# EAGLE design Guitar-Controller (EAGLE 6.4)
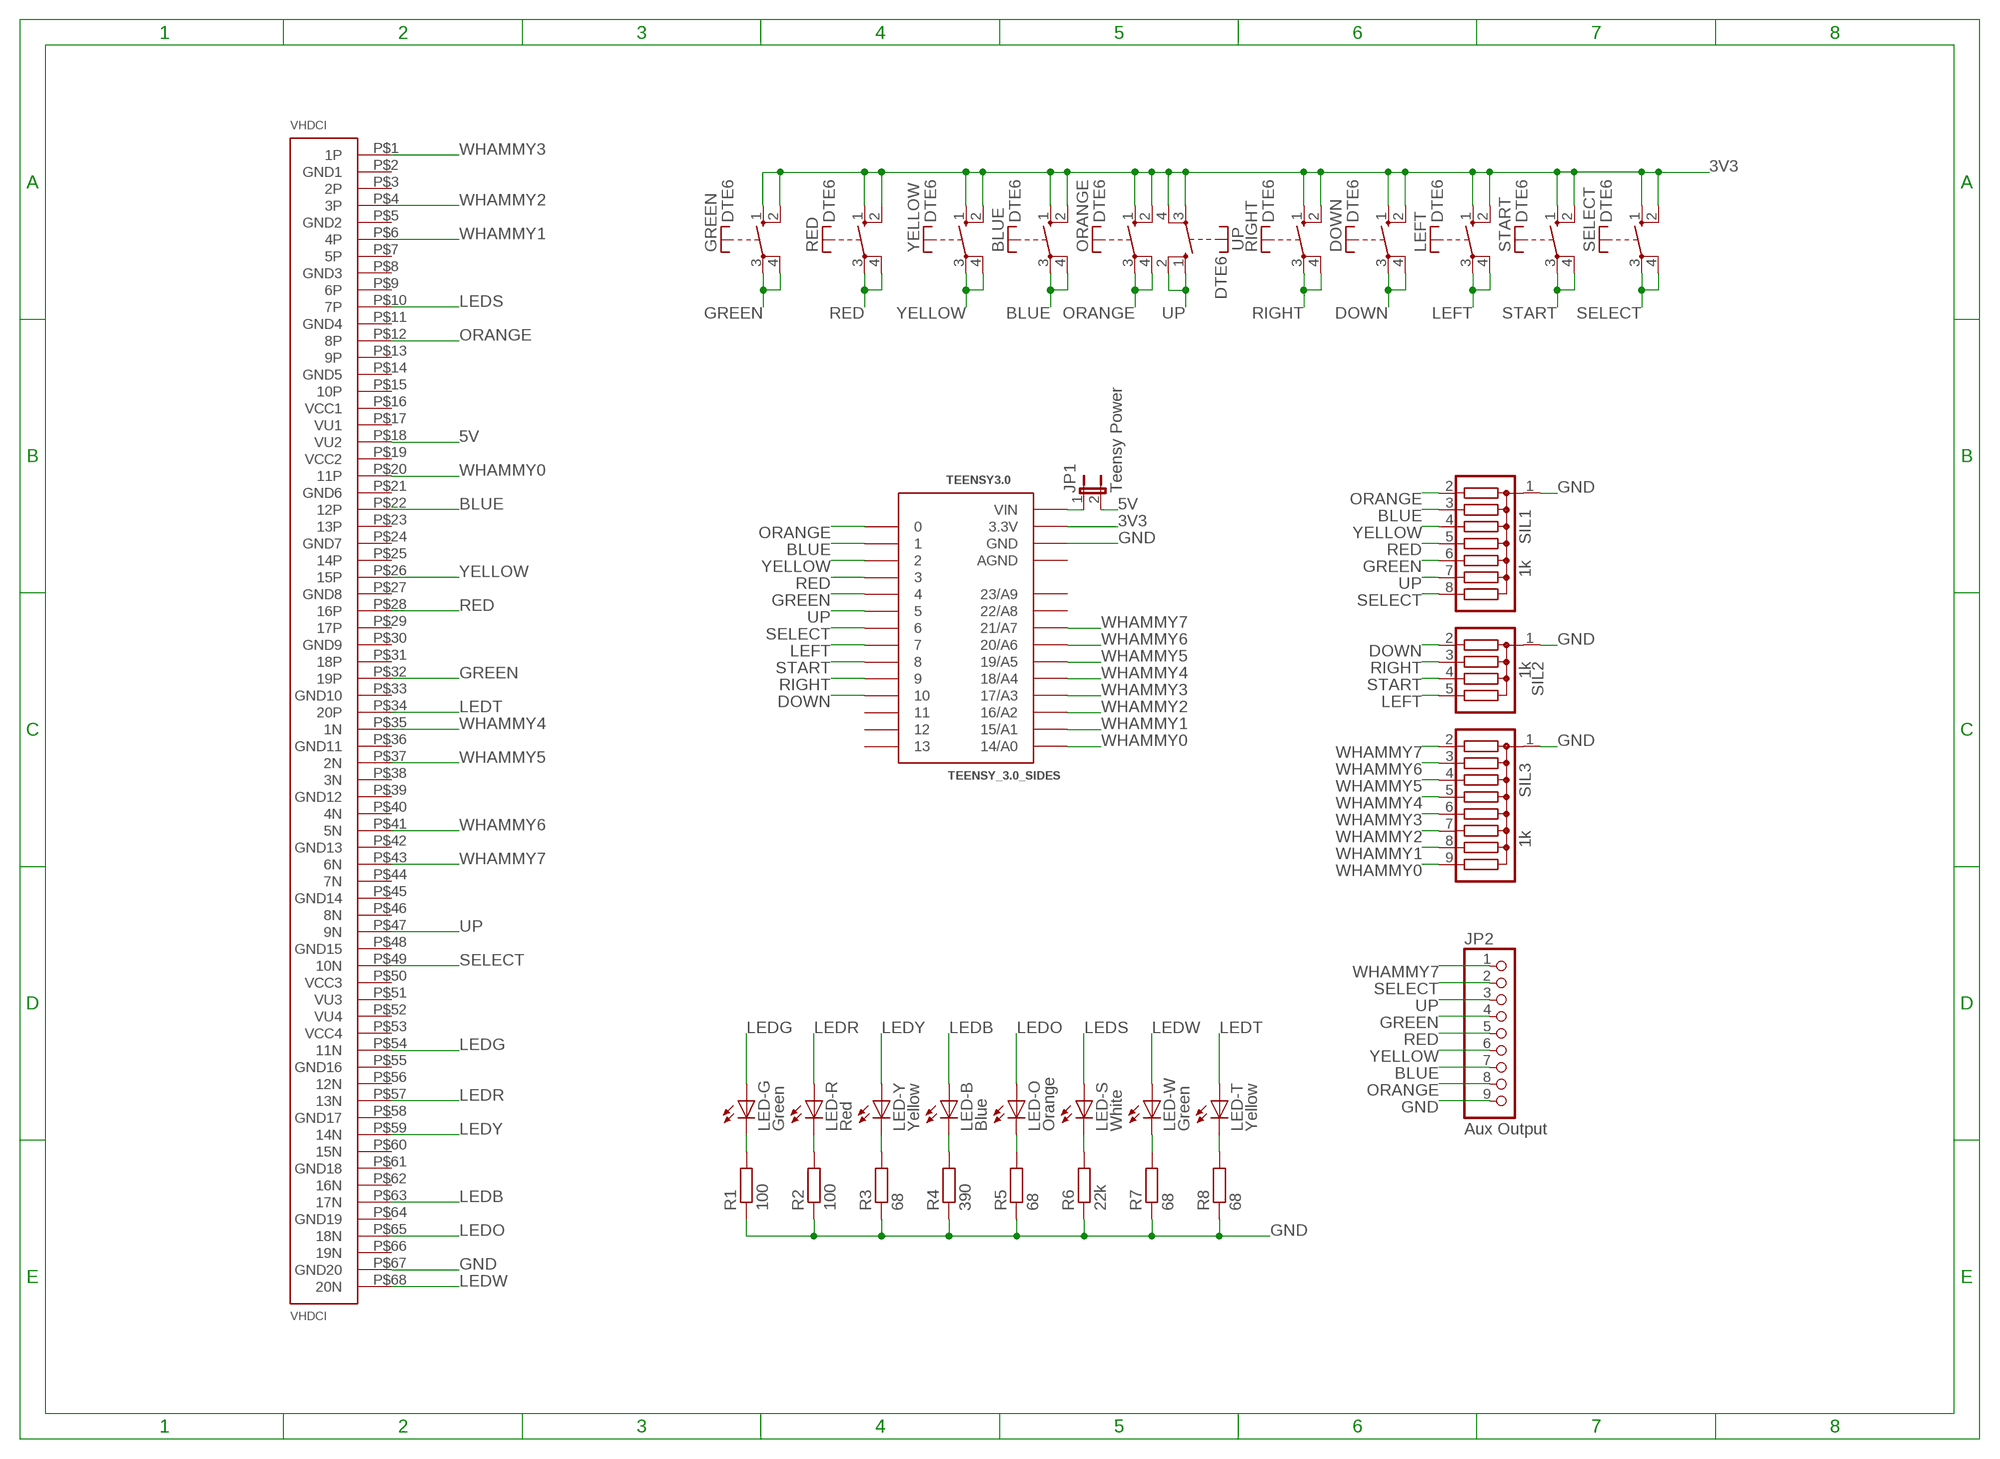
[diagram p0: schematic, sheet 1]

## Parts
BLUE  DTE6  [DTE6]
DOWN  DTE6  [DTE6]
GREEN  DTE6  [DTE6]
JP1  Teensy Power  JP1E  [JP1]
JP2  Aux Output  PINHD-1X9/90  [1X09/90]
LED-B  Blue  LEDSQR2X5  [LED2X5]
LED-G  Green  LEDSQR2X5  [LED2X5]
LED-O  Orange  LEDSQR2X5  [LED2X5]
LED-R  Red  LEDSQR2X5  [LED2X5]
LED-S  White  LED5MM  [LED5MM]
LED-T  Yellow  LED3MM  [LED3MM]
LED-W  Green  LED3MM  [LED3MM]
LED-Y  Yellow  LEDSQR2X5  [LED2X5]
LEFT  DTE6  [DTE6]
ORANGE  DTE6  [DTE6]
R1  100  R-EU_R0805  [R0805]
R2  100  R-EU_R0805  [R0805]
R3  68  R-EU_R0805  [R0805]
R4  390  R-EU_R0805  [R0805]
R5  68  R-EU_R0805  [R0805]
R6  22k  R-EU_R0805  [R0805]
R7  68  R-EU_R0805  [R0805]
R8  68  R-EU_R0805  [R0805]
RED  DTE6  [DTE6]
RIGHT  DTE6  [DTE6]
SELECT  DTE6  [DTE6]
SIL1  1k  G07R  [SIL8]
SIL2  1k  G04R  [SIL5]
SIL3  1k  G08R  [SIL9]
START  DTE6  [DTE6]
TEENSY3.0  TEENSY_3.0_SIDES  [TEENSY_3.0_SIDES]
UP  DTE6  [DTE6]
VHDCI  VHDCI-PLUG  [R-HI-008068-2]
YELLOW  DTE6  [DTE6]

## Nets
3V3: BLUE.1(S) BLUE.2(S) DOWN.1(S) DOWN.2(S) GREEN.1(S) GREEN.2(S) LEFT.1(S) LEFT.2(S) ORANGE.1(S) ORANGE.2(S) RED.1(S) RED.2(S) RIGHT.1(S) RIGHT.2(S) SELECT.1(S) SELECT.2(S) START.1(S) START.2(S) TEENSY3.0.3.3V UP.3(P) UP.4(P) YELLOW.1(S) YELLOW.2(S)
5V: JP1.2 VHDCI.P$18(VU2)
BLUE: BLUE.3(P) BLUE.4(P) JP2.7 SIL1.3 TEENSY3.0.1 VHDCI.P$22(12P)
DOWN: DOWN.3(P) DOWN.4(P) SIL2.2 TEENSY3.0.10
GND: JP2.9 R1.1 R2.1 R3.1 R4.1 R5.1 R6.1 R7.1 R8.1 SIL1.1 SIL2.1 SIL3.1 TEENSY3.0.GND VHDCI.P$67(GND20)
GREEN: GREEN.3(P) GREEN.4(P) JP2.4 SIL1.6 TEENSY3.0.4 VHDCI.P$32(19P)
LEDB: LED-B.A VHDCI.P$63(17N)
LEDG: LED-G.A VHDCI.P$54(11N)
LEDO: LED-O.A VHDCI.P$65(18N)
LEDR: LED-R.A VHDCI.P$57(13N)
LEDS: LED-S.A VHDCI.P$10(7P)
LEDT: LED-T.A VHDCI.P$34(20P)
LEDW: LED-W.A VHDCI.P$68(20N)
LEDY: LED-Y.A VHDCI.P$59(14N)
LEFT: LEFT.3(P) LEFT.4(P) SIL2.5 TEENSY3.0.7
N$33: LED-R.K(C) R2.2
N$34: LED-G.K(C) R1.2
N$35: LED-Y.K(C) R3.2
N$36: LED-B.K(C) R4.2
N$37: LED-O.K(C) R5.2
N$38: LED-S.K(C) R6.2
N$39: LED-W.K(C) R7.2
N$40: LED-T.K(C) R8.2
N$43: JP1.1 TEENSY3.0.VIN
ORANGE: JP2.8 ORANGE.3(P) ORANGE.4(P) SIL1.2 TEENSY3.0.0 VHDCI.P$12(8P)
RED: JP2.5 RED.3(P) RED.4(P) SIL1.5 TEENSY3.0.3 VHDCI.P$28(16P)
RIGHT: RIGHT.3(P) RIGHT.4(P) SIL2.3 TEENSY3.0.9
SELECT: JP2.2 SELECT.3(P) SELECT.4(P) SIL1.8 TEENSY3.0.6 VHDCI.P$49(10N)
START: SIL2.4 START.3(P) START.4(P) TEENSY3.0.8
UP: JP2.3 SIL1.7 TEENSY3.0.5 UP.1(S) UP.2(S) VHDCI.P$47(9N)
WHAMMY0: SIL3.9 TEENSY3.0.14/A0 VHDCI.P$20(11P)
WHAMMY1: SIL3.8 TEENSY3.0.15/A1 VHDCI.P$6(4P)
WHAMMY2: SIL3.7 TEENSY3.0.16/A2 VHDCI.P$4(3P)
WHAMMY3: SIL3.6 TEENSY3.0.17/A3 VHDCI.P$1(1P)
WHAMMY4: SIL3.5 TEENSY3.0.18/A4 VHDCI.P$35(1N)
WHAMMY5: SIL3.4 TEENSY3.0.19/A5 VHDCI.P$37(2N)
WHAMMY6: SIL3.3 TEENSY3.0.20/A6 VHDCI.P$41(5N)
WHAMMY7: JP2.1 SIL3.2 TEENSY3.0.21/A7 VHDCI.P$43(6N)
YELLOW: JP2.6 SIL1.4 TEENSY3.0.2 VHDCI.P$26(15P) YELLOW.3(P) YELLOW.4(P)
Unconnected: TEENSY3.0.11 TEENSY3.0.12 TEENSY3.0.13 TEENSY3.0.22/A8 TEENSY3.0.23/A9 VHDCI.P$2(GND1) VHDCI.P$3(2P) VHDCI.P$5(GND2) VHDCI.P$7(5P) VHDCI.P$8(GND3) VHDCI.P$9(6P) VHDCI.P$11(GND4) VHDCI.P$13(9P) VHDCI.P$14(GND5) VHDCI.P$15(10P) VHDCI.P$16(VCC1) VHDCI.P$17(VU1) VHDCI.P$19(VCC2) VHDCI.P$21(GND6) VHDCI.P$23(13P) VHDCI.P$24(GND7) VHDCI.P$25(14P) VHDCI.P$27(GND8) VHDCI.P$29(17P) VHDCI.P$30(GND9) VHDCI.P$31(18P) VHDCI.P$33(GND10) VHDCI.P$36(GND11) VHDCI.P$38(3N) VHDCI.P$39(GND12) VHDCI.P$40(4N) VHDCI.P$42(GND13) VHDCI.P$44(7N) VHDCI.P$45(GND14) VHDCI.P$46(8N) VHDCI.P$48(GND15) VHDCI.P$50(VCC3) VHDCI.P$51(VU3) VHDCI.P$52(VU4) VHDCI.P$53(VCC4) VHDCI.P$55(GND16) VHDCI.P$56(12N) VHDCI.P$58(GND17) VHDCI.P$60(15N) VHDCI.P$61(GND18) VHDCI.P$62(16N) VHDCI.P$64(GND19) VHDCI.P$66(19N)

## Power pins joined to a net without a drawn wire
AGND: TEENSY3.0.AGND

## Library data of the parts
BLUE DOWN GREEN LEFT ORANGE RED RIGHT SELECT START UP YELLOW = switch-misc:DT: ITT SWITCH
JP1 = jumper:JP1E: JUMPER
JP2 = pinhead:PINHD-1X9: PIN HEADER
LED-B LED-G LED-O LED-R LED-S LED-T LED-W LED-Y = led:LED: LED OSRAM: - CHIPLED LG R971, LG N971, LY N971, LG Q971, LY Q971, LO R971, LY R971 LH N974, LH R974 LS Q976, LO Q976, LY Q976 LO Q996 - Hyper CHIPLED LW Q18S LB Q993, LB Q99A, LB R99A - SideLED LS A670, LO A670, LY A670, LG A670, LP A670 LB A673, LV A673, LT A673, LW A673 LH A674 LY A675 LS A676, LA A676, LO A676, LY A676, LW A676 LS A679, LY A679, LG A679 - Hyper Micro SIDELED® LS Y876, LA Y876, LO Y876, LY Y876 LT Y87S - SmartLED LW L88C, LW L88S LB L89C, LB L89S, LG L890 LS L89K, LO L89K, LY L89K LS L896, LA L896, LO L896, LY L896 - TOPLED LS T670, LO T670, LY T670, LG T670, LP T670 LSG T670, LSP T670, LSY T670, LOP T670, LYG T670 LG T671, LOG T671, LSG T671 LB T673, LV T673, LT T673, LW T673 LH T674 LS T676, LA T676, LO T676, LY T676, LB T676, LH T676, LSB T676, LW T676 LB T67C, LV T67C, LT T67C, LS T67K, LO T67K, LY T67K, LW E67C LS E67B, LA E67B, LO E67B, LY E67B, LB E67C, LV E67C, LT E67C LW T67C LS T679, LY T679, LG T679 LS T770, LO T770, LY T770, LG T770, LP T770 LB T773, LV T773, LT T773, LW T773 LH T774 LS E675, LA E675, LY E675, LS T675 LS T776, LA T776, LO T776, LY T776, LB T776 LHGB T686 LT T68C, LB T68C - Hyper Mini TOPLED® LB M676 - Mini TOPLED Santana® LG M470 LS M47K, LO M47K, LY M47K Source: http://www.osram.convergy.de LUXEON: - LUMILED® LXK2-PW12-R00, LXK2-PW12-S00, LXK2-PW14-U00, LXK2-PW14-V00 LXK2-PM12-R00, LXK2-PM12-S00, LXK2-PM14-U00 LXK2-PE12-Q00, LXK2-PE12-R00, LXK2-PE12-S00, LXK2-PE14-T00, LXK2-PE14-U00 LXK2-PB12-K00, LXK2-PB12-L00, LXK2-PB12-M00, LXK2-PB14-N00, LXK2-PB14-P00, LXK2-PB14-Q00 LXK2-PR12-L00, LXK2-PR12-M00, LXK2-PR14-Q00, LXK2-PR14-R00 LXK2-PD12-Q00, LXK2-PD12-R00, LXK2-PD12-S00 LXK2-PH12-R00, LXK2-PH12-S00 LXK2-PL12-P00, LXK2-PL12-Q00, LXK2-PL12-R00 Source: www.luxeon.com KINGBRIGHT: KA-3528ASYC Source: www.kingbright.com
R1-R8 = resistor:R-EU_: RESISTOR, European symbol
SIL1 = resistor-sil:G07R: SIL RESISTOR; OC_FARNELL: unknown; OC_NEWARK: unknown
SIL2 = resistor-sil:G04R: SIL RESISTOR; OC_FARNELL: unknown; OC_NEWARK: unknown
SIL3 = resistor-sil:G08R: SIL RESISTOR; OC_FARNELL: unknown; OC_NEWARK: unknown
TEENSY3.0 = Teensy3.0:TEENSY_3.0_SIDES: Teensy 3.0 Board outline with only side pins.
VHDCI = VHDCI:VHDCI-PLUG: VHDCI Plug - 68 pins

## Board
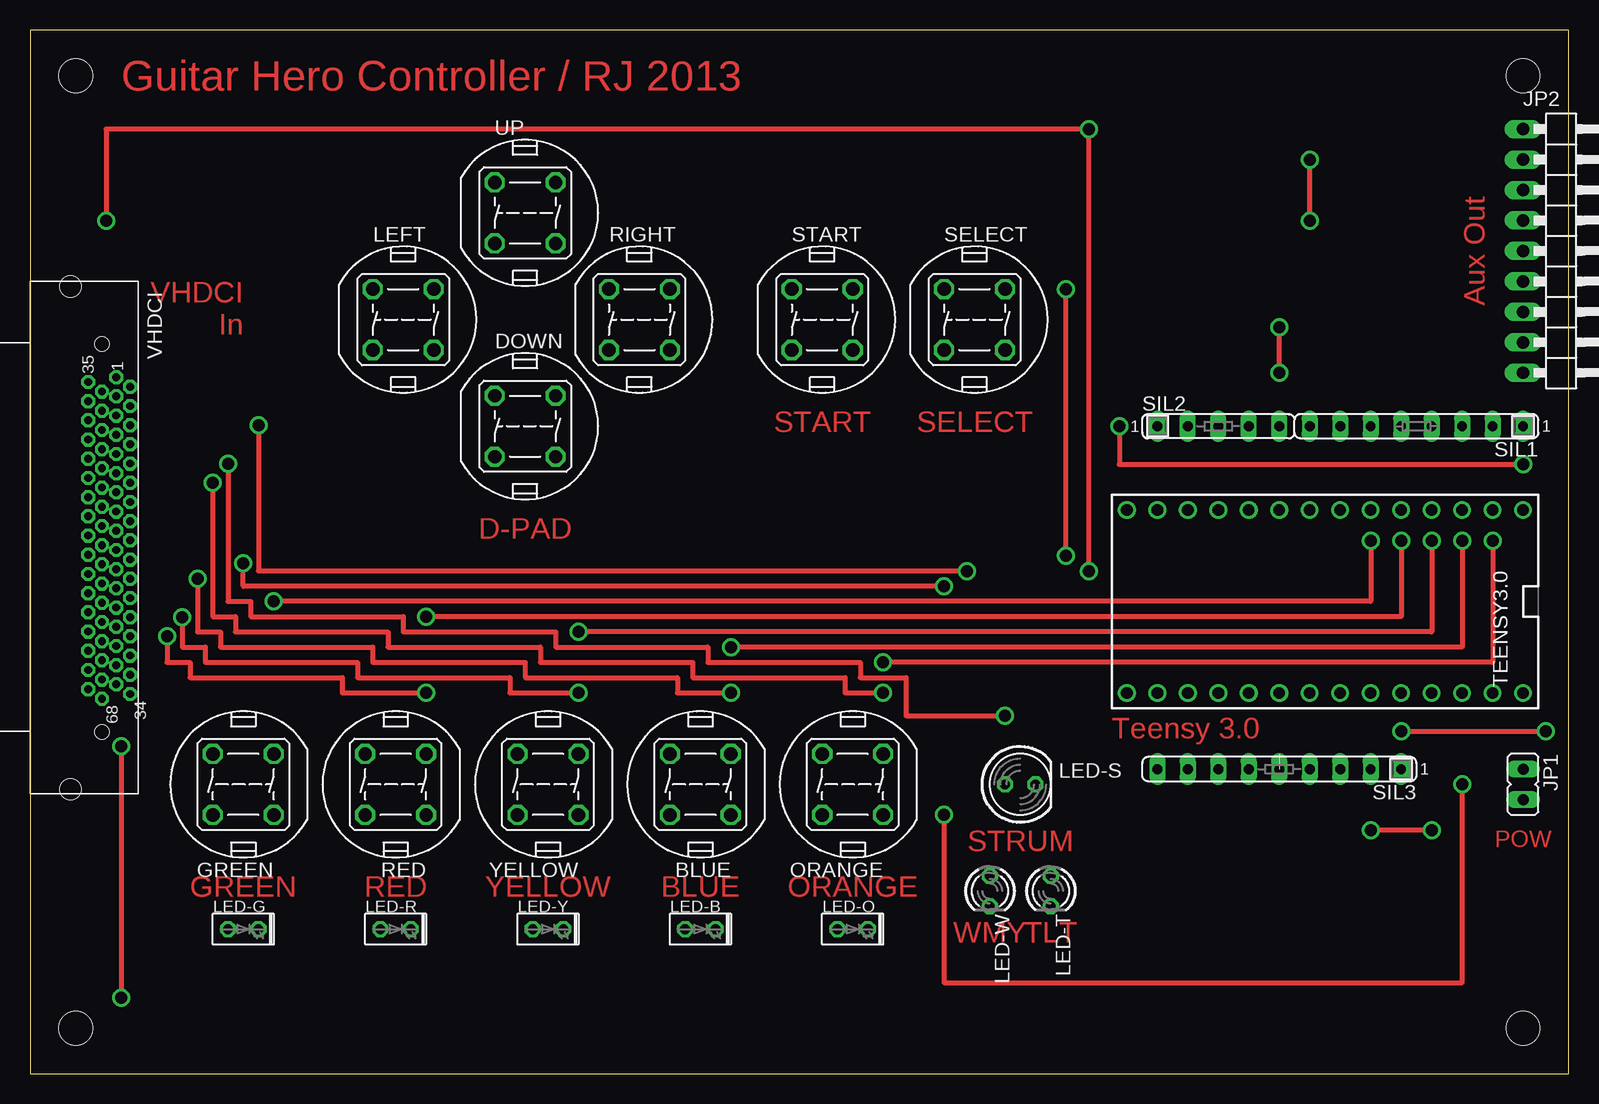
[diagram p1: board, top side]
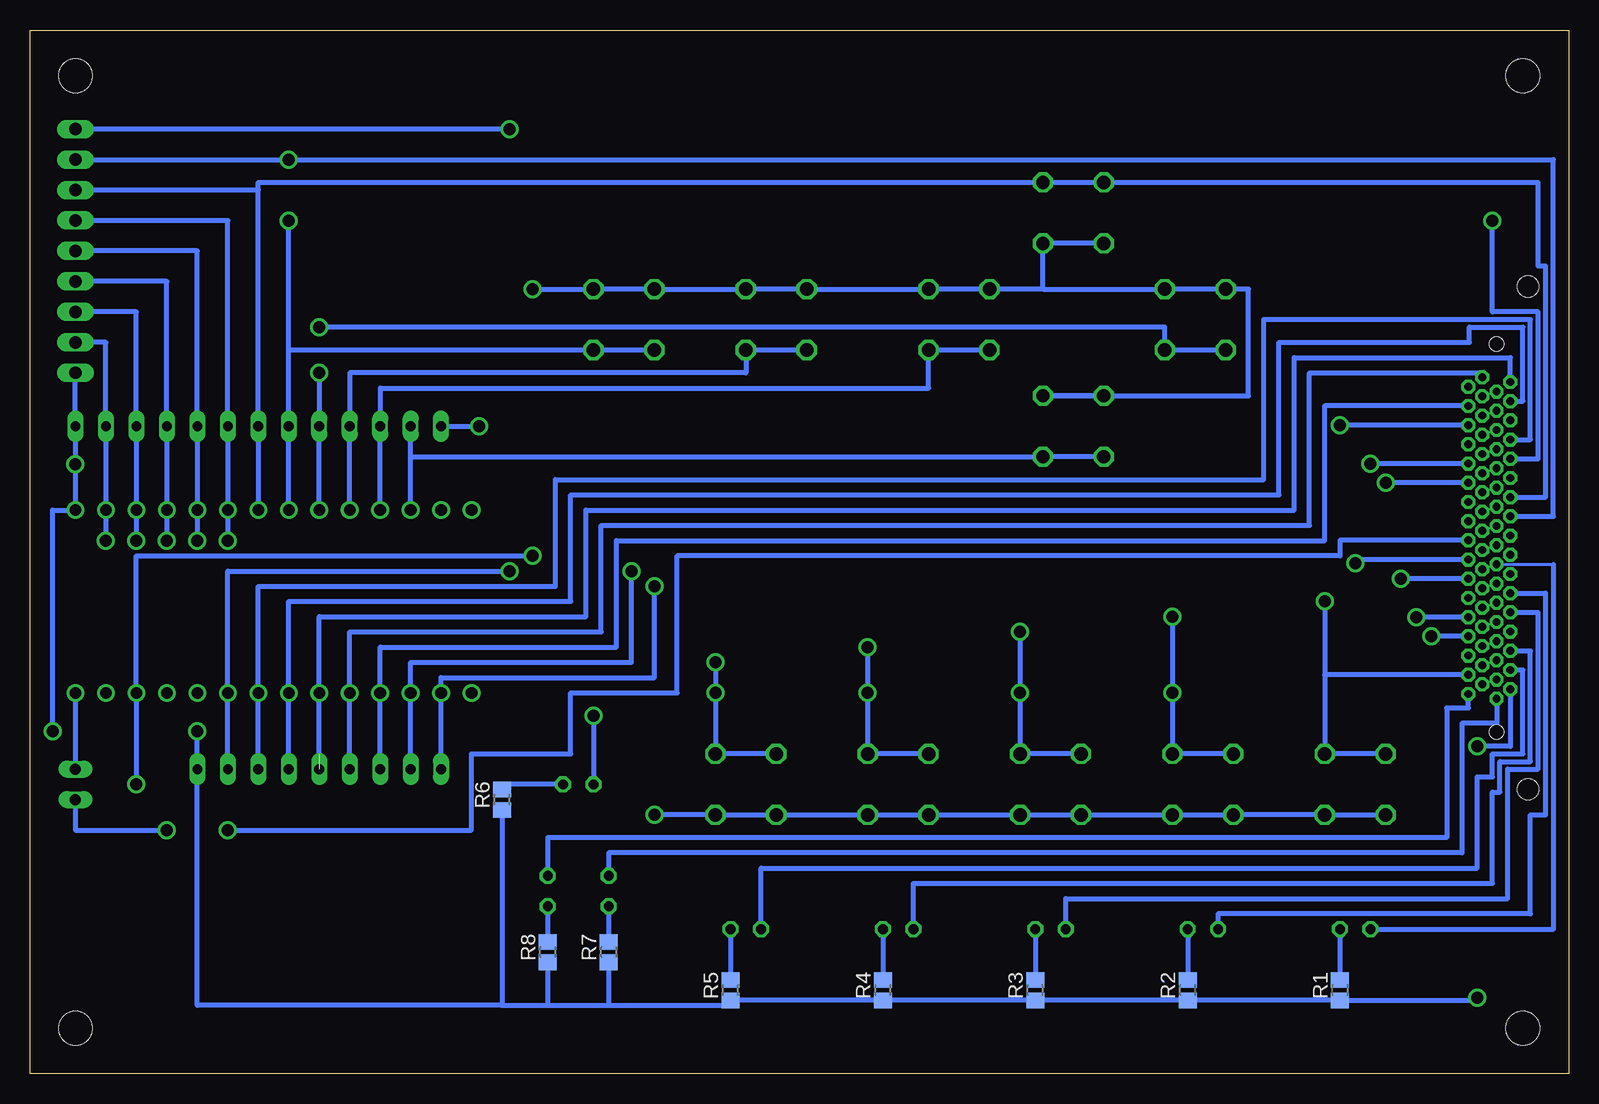
[diagram p2: board, bottom side, seen from below]

Size 128.25 x 86.99 mm. Coordinates in mm from the lower left corner, seen from the top.
Outline: 0,0 128.25,0 128.25,86.99 0,86.99 0,0
Copper layers (1*16): Top 0.035mm / dielectric 1.5mm / Bottom 0.035mm
Design rules "default": minimum track width 10mil, minimum drill 24mil, track to track 8mil, track to pad 8mil, pad to pad 8mil, via to via 8mil, smd to smd 8mil, copper to edge 40mil, drill to drill 8mil, minimum pad ring 10mil, minimum via ring 8mil, stop-mask expansion 4mil, vias tented up to drill 0mil, thermal gap 10mil
Holes 2.8 mm at 3.81,3.81 124.46,3.81 124.46,83.19 3.81,83.19

### Footprints (pad centres in the part's own frame; a part is rotated, then mirrored left to right if it is on the bottom)
DTE6 = drill 1.118 octagon: 1 -2.54,2.54; 2 2.54,2.54; 3 2.54,-2.54; 4 -2.54,-2.54
JP1 = drill 0.914 long: 1 0,-1.27; 2 0,1.27
1X09/90 = drill 1.016 long: 1 -10.16,-3.81; 2 -7.62,-3.81; 3 -5.08,-3.81; 4 -2.54,-3.81; 5 0,-3.81; 6 2.54,-3.81; 7 5.08,-3.81; 8 7.62,-3.81; 9 10.16,-3.81
LED2X5 = drill 0.813 octagon: A -1.27,0; K 1.27,0
LED5MM = drill 0.813 octagon: A -1.27,0; K 1.27,0
LED3MM = drill 0.813 octagon: A -1.27,0; K 1.27,0
R0805 = smd 1.3 x 1.5: 1 -0.85,0; 2 0.85,0
SIL8 = drill 0.813 long: 1 -8.89,0; 2 -6.35,0; 3 -3.81,0; 4 -1.27,0; 5 1.27,0; 6 3.81,0; 7 6.35,0; 8 8.89,0
SIL5 = drill 0.813 long: 1 -5.08,0; 2 -2.54,0; 3 0,0; 4 2.54,0; 5 5.08,0
SIL9 = drill 0.813 long: 1 -10.16,0; 2 -7.62,0; 3 -5.08,0; 4 -2.54,0; 5 0,0; 6 2.54,0; 7 5.08,0; 8 7.62,0; 9 10.16,0
TEENSY_3.0_SIDES = drill 0.965: 0 -7.62,13.97; 1 -7.62,11.43; 2 -7.62,8.89; 3 -7.62,6.35; 3.3V 7.62,11.43; 4 -7.62,3.81; 5 -7.62,1.27; 6 -7.62,-1.27; 7 -7.62,-3.81; 8 -7.62,-6.35; 9 -7.62,-8.89; 10 -7.62,-11.43; 11 -7.62,-13.97; 12 -7.62,-16.51; 13 7.62,-16.51; 14/A0 7.62,-13.97; 15/A1 7.62,-11.43; 16/A2 7.62,-8.89; 17/A3 7.62,-6.35; 18/A4 7.62,-3.81; 19/A5 7.62,-1.27; 20/A6 7.62,1.27; 21/A7 7.62,3.81; 22/A8 7.62,6.35; 23/A9 7.62,8.89; AGND 7.62,13.97; GND -7.62,16.51; VIN 7.62,16.51
R-HI-008068-2 = drill 0.65 pad 1 octagon: P$1 7.975,7.2; P$2 8.775,8.35; P$3 9.575,7.2; P$4 10.375,8.35; P$5 11.175,7.2; P$6 11.975,8.35; P$7 12.775,7.2; P$8 13.575,8.35; P$9 14.375,7.2; P$10 15.175,8.35; P$11 15.975,7.2; P$12 16.775,8.35; P$13 17.575,7.2; P$14 18.375,8.35; P$15 19.175,7.2; P$16 19.975,8.35; P$17 20.775,7.2; P$18 21.575,8.35; P$19 22.375,7.2; P$20 23.175,8.35; P$21 23.975,7.2; P$22 24.775,8.35; P$23 25.575,7.2; P$24 26.375,8.35; P$25 27.175,7.2; P$26 27.975,8.35; P$27 28.775,7.2; P$28 29.575,8.35; P$29 30.375,7.2; P$30 31.175,8.35; P$31 31.975,7.2; P$32 32.775,8.35; P$33 33.575,7.2; P$34 34.375,8.35; P$35 8.375,4.85; P$36 9.175,6; P$37 9.975,4.85; P$38 10.775,6; P$39 11.575,4.85; P$40 12.375,6; P$41 13.175,4.85; P$42 13.975,6; P$43 14.775,4.85; P$44 15.575,6; P$45 16.375,4.85; P$46 17.175,6; P$47 17.975,4.85; P$48 18.775,6; P$49 19.575,4.85; P$50 20.375,6; P$51 21.175,4.85; P$52 21.975,6; P$53 22.775,4.85; P$54 23.575,6; P$55 24.375,4.85; P$56 25.175,6; P$57 25.975,4.85; P$58 26.775,6; P$59 27.575,4.85; P$60 28.375,6; P$61 29.175,4.85; P$62 29.975,6; P$63 30.775,4.85; P$64 31.575,6; P$65 32.375,4.85; P$66 33.175,6; P$67 33.975,4.85; P$68 34.775,6 | hole 1.2: 5.2,6; 37.55,6 | hole 1.75: 0.425,3.375; 42.325,3.375

### Placement (x,y rotation side)
BLUE  55.88,24.13 180 top
DOWN  41.27,53.98 0 top
GREEN  17.78,24.13 180 top
JP1  124.46,24.13 180 top
JP2  128.27,68.58 270 top
LED-B  55.88,12.06 0 top
LED-G  17.78,12.06 0 top
LED-O  68.58,12.06 0 top
LED-R  30.48,12.06 0 top
LED-S  82.55,24.13 0 top
LED-T  85.09,15.24 270 top
LED-W  80.01,15.24 270 top
LED-Y  43.18,12.06 0 top
LEFT  31.11,62.87 0 top
ORANGE  68.58,24.13 180 top
R1  19.05,6.99 90 bottom
R2  31.75,6.99 90 bottom
R3  44.45,6.99 90 bottom
R4  57.15,6.99 90 bottom
R5  69.85,6.99 90 bottom
R6  88.9,22.86 90 bottom
R7  80.01,10.16 90 bottom
R8  85.09,10.16 90 bottom
RED  30.48,24.13 180 top
RIGHT  50.8,62.87 0 top
SELECT  78.74,62.87 0 top
SIL1  115.57,53.98 180 top
SIL2  99.06,53.98 0 top
SIL3  104.14,25.4 180 top
START  66.04,62.87 0 top
TEENSY3.0  107.95,39.37 270 top
UP  41.27,71.75 0 top
VHDCI  0,66.04 270 top
YELLOW  43.18,24.13 180 top

### Tracks (layer width: path | path; a pad name or v marks a point on that pad's centre or on a via)
3V3  (via drill 1, 1 pad 1.27)
  Top 0.406: v76.2,21.59 76.2,7.62 119.38,7.62 v119.38,24.13 | v86.36,43.18 v86.36,65.41
  Bottom 0.406: GREEN.2 GREEN.1 RED.2 RED.1 YELLOW.2 YELLOW.1 BLUE.2 BLUE.1 ORANGE.2 ORANGE.1 v76.2,21.59 | v119.38,24.13 TEENSY3.0.3.3V 119.38,43.18 v86.36,43.18 | DOWN.1 DOWN.2 26.67,56.52 26.67,65.41 LEFT.1 LEFT.2 43.81,65.41 | 43.81,65.41 RIGHT.1 RIGHT.2 START.1 START.2 SELECT.1 SELECT.2 v86.36,65.41 | UP.4 UP.3 43.81,65.41
5V  (via drill 1 pad 1.27)
  Top 0.406: v116.84,20.32 v111.76,20.32
  Bottom 0.406: JP1.2 124.46,20.32 v116.84,20.32 | v111.76,20.32 91.44,20.32 91.44,26.67 83.19,26.67 83.19,31.75 74.3,31.75 74.3,43.18 19.05,43.18 19.05,44.47 VHDCI.P$18
BLUE  (via drill 1, 1 pad 1.27)
  Top 0.406: v119.38,44.45 119.38,35.56 v58.42,35.56 | v13.97,41.27 13.97,36.83 15.88,36.83 15.88,35.56 28.57,35.56 28.57,34.29 41.27,34.29 41.27,33.02 53.98,33.02 53.98,31.75 v58.42,31.75
  Bottom 0.406: BLUE.3 BLUE.4 v58.42,31.75 v58.42,35.56 | JP2.7 119.38,63.5 SIL1.3 TEENSY3.0.1 v119.38,44.45 | VHDCI.P$22 v13.97,41.27
DOWN
  Bottom 0.406: DOWN.4 DOWN.3 96.52,51.44 | TEENSY3.0.10 96.52,51.44 | 96.52,51.44 SIL2.2
GND  (via drill 1, 1 pad 1.27)
  Top 0.406: v114.3,28.57 v126.36,28.57 | v7.62,27.3 v7.62,6.35 | v90.81,53.98 90.81,50.8 v124.46,50.8
  Bottom 0.406: JP2.9 SIL1.1 v124.46,50.8 TEENSY3.0.GND 126.36,46.99 v126.36,28.57 | 88.9,5.72 114.3,5.72 SIL3.1 v114.3,28.57 | R6.1 88.9,5.72 | VHDCI.P$67 4.85,27.3 v7.62,27.3 | 88.9,5.72 85.09,5.72 | 85.09,5.72 80.01,5.72 | 80.01,5.72 69.85,5.72 R5.1 R4.1 R3.1 R2.1 R1.1 7.62,6.14 v7.62,6.35 | R8.1 85.09,5.72 | R7.1 80.01,5.72 | SIL2.1 v90.81,53.98
GREEN  (via drill 1 pad 1.27)
  Top 0.406: v111.76,44.45 111.76,39.37 v20.32,39.37
  Bottom 0.406: GREEN.3 GREEN.4 20.32,33.27 | JP2.4 111.76,71.12 SIL1.6 TEENSY3.0.4 v111.76,44.45 | v20.32,39.37 20.32,33.27 | VHDCI.P$32 20.32,33.27
LEDB
  Bottom 0.406: LED-B.A 54.61,15.88 6.35,15.88 6.35,23.49 5.71,23.49 5.71,26.04 3.17,26.04 3.17,35.27 VHDCI.P$63
LEDG
  Bottom 0.254: VHDCI.P$54 1.27,42.47
  Bottom 0.406: LED-G.A 1.27,12.06 1.27,42.47
LEDO
  Bottom 0.406: LED-O.A 67.31,17.14 7.62,17.14 7.62,24.76 6.35,24.76 6.35,26.67 3.81,26.67 3.81,33.66 VHDCI.P$65
LEDR
  Bottom 0.406: VHDCI.P$57 1.91,40.07 1.91,21.59 3.17,21.59 3.17,13.33 29.21,13.33 LED-R.A
LEDS  (via drill 1 pad 1.27)
  Top 0.406: v81.28,29.85 73.03,29.85 73.03,33.02 69.22,33.02 69.22,34.29 56.52,34.29 56.52,35.56 43.81,35.56 43.81,36.83 31.11,36.83 31.11,38.1 18.41,38.1 18.41,39.37 16.51,39.37 v16.51,50.87
  Bottom 0.406: VHDCI.P$10 v16.51,50.87 | v81.28,29.85 LED-S.A
LEDT
  Bottom 0.406: LED-T.A 85.09,19.68 10.16,19.68 10.16,30.48 8.35,30.48 VHDCI.P$34
LEDW
  Bottom 0.406: VHDCI.P$68 6,29.21 8.89,29.21 8.89,18.41 80.01,18.41 LED-W.A
LEDY
  Bottom 0.406: LED-Y.A 41.91,14.61 5.08,14.61 5.08,25.4 2.54,25.4 2.54,38.47 VHDCI.P$59
LEFT  (via drill 1 pad 1.27)
  Top 0.406: v104.14,58.42 v104.14,62.23
  Bottom 0.406: LEFT.4 LEFT.3 33.66,62.23 v104.14,62.23 | TEENSY3.0.7 SIL2.5 v104.14,58.42
N$33
  Bottom 0.406: LED-R.K R2.2
N$34
  Bottom 0.406: LED-G.K R1.2
N$35
  Bottom 0.406: LED-Y.K R3.2
N$36
  Bottom 0.406: LED-B.K R4.2
N$37
  Bottom 0.406: LED-O.K R5.2
N$38
  Bottom 0.406: LED-S.K 88.9,24.13 R6.2
N$39
  Bottom 0.406: LED-W.K R7.2
N$40
  Bottom 0.406: LED-T.K R8.2
N$43
  Bottom 0.406: TEENSY3.0.VIN JP1.1
ORANGE  (via drill 1, 1 pad 1.27)
  Top 0.406: v121.92,44.45 121.92,34.29 v71.12,34.29 | v15.24,49.27 15.24,38.1 17.14,38.1 17.14,36.83 29.84,36.83 29.84,35.56 42.55,35.56 42.55,34.29 55.24,34.29 55.24,33.02 67.94,33.02 67.94,31.75 v71.12,31.75
  Bottom 0.406: ORANGE.3 ORANGE.4 v71.12,31.75 v71.12,34.29 | JP2.8 121.92,60.96 SIL1.2 TEENSY3.0.0 v121.92,44.45 | VHDCI.P$12 v15.24,49.27
RED  (via drill 1, 1 pad 1.27)
  Top 0.406: v114.3,44.45 114.3,38.1 v33.02,38.1 | v11.43,36.47 11.43,34.29 13.34,34.29 13.34,33.02 26.04,33.02 26.04,31.75 v33.02,31.75
  Bottom 0.406: RED.3 RED.4 v33.02,31.75 v33.02,38.1 | JP2.5 114.3,68.58 SIL1.5 TEENSY3.0.3 v114.3,44.45 | VHDCI.P$28 v11.43,36.47
RIGHT
  Bottom 0.406: RIGHT.4 RIGHT.3 53.34,57.15 99.06,57.15 SIL2.3 TEENSY3.0.9
SELECT  (via drill 1 pad 1.27)
  Top 0.406: v106.68,71.12 v106.68,76.2
  Bottom 0.406: JP2.2 v106.68,76.2 1.27,76.2 1.27,46.47 VHDCI.P$49 | TEENSY3.0.6 SIL1.8 106.68,60.32 | SELECT.4 SELECT.3 106.68,60.32 | 106.68,60.32 v106.68,71.12
START
  Bottom 0.406: START.4 START.3 68.58,58.42 101.6,58.42 SIL2.4 TEENSY3.0.8
UP
  Bottom 0.406: 109.22,73.66 JP2.3 | 109.22,73.66 SIL1.7 TEENSY3.0.5 | 109.22,73.66 109.22,74.3 UP.2 UP.1 2.54,74.3 2.54,67.31 1.91,67.31 1.91,48.07 VHDCI.P$47
WHAMMY0  (via drill 1, 1 pad 1.27)
  Top 0.406: v76.2,40.64 17.78,40.64 v17.78,42.55
  Bottom 0.406: SIL3.9 TEENSY3.0.14/A0 93.98,33.02 76.2,33.02 v76.2,40.64 | VHDCI.P$20 17.78,42.87 v17.78,42.55
WHAMMY1  (via drill 1 pad 1.27)
  Top 0.406: v19.05,54.07 19.05,41.91 v78.11,41.91
  Bottom 0.406: SIL3.8 TEENSY3.0.15/A1 96.52,34.29 78.11,34.29 v78.11,41.91 | VHDCI.P$6 v19.05,54.07
WHAMMY2
  Bottom 0.406: SIL3.7 TEENSY3.0.16/A2 99.06,35.56 79.38,35.56 79.38,44.45 20.32,44.45 20.32,55.66 VHDCI.P$4
WHAMMY3
  Bottom 0.406: SIL3.6 TEENSY3.0.17/A3 101.6,36.83 80.64,36.83 80.64,45.72 21.59,45.72 21.59,58.42 7.2,58.42 VHDCI.P$1
WHAMMY4  (1 unrouted)
  Bottom 0.406: 104.14,26.67 TEENSY3.0.18/A4 104.14,38.1 81.92,38.1 81.92,46.99 22.86,46.99 22.86,59.69 4.85,59.69 VHDCI.P$35
WHAMMY5
  Bottom 0.406: SIL3.4 TEENSY3.0.19/A5 106.68,39.37 83.19,39.37 83.19,48.26 24.13,48.26 24.13,60.96 8.26,60.96 8.26,62.23 3.81,62.23 3.81,56.07 VHDCI.P$37
WHAMMY6
  Bottom 0.406: SIL3.3 TEENSY3.0.20/A6 109.22,40.64 84.45,40.64 84.45,49.53 25.4,49.53 25.4,62.87 3.17,62.87 3.17,52.87 VHDCI.P$41
WHAMMY7  (via drill 1, 1 pad 1.27)
  Top 0.406: v88.27,41.91 v88.27,78.74 6.35,78.74 v6.35,71.12
  Bottom 0.406: SIL3.2 TEENSY3.0.21/A7 111.76,41.91 v88.27,41.91 | v88.27,78.74 JP2.1 | VHDCI.P$43 2.54,51.27 2.54,63.5 6.35,63.5 v6.35,71.12
YELLOW  (via drill 1, 1 pad 1.27)
  Top 0.406: v116.84,44.45 116.84,36.83 v45.72,36.83 | v12.7,38.07 12.7,35.56 14.61,35.56 14.61,34.29 27.3,34.29 27.3,33.02 40.01,33.02 40.01,31.75 v45.72,31.75
  Bottom 0.406: JP2.6 116.84,66.04 SIL1.4 TEENSY3.0.2 v116.84,44.45 | YELLOW.3 YELLOW.4 v45.72,31.75 v45.72,36.83 | VHDCI.P$26 v12.7,38.07

### Text on the board
Top: Guitar Hero Controller / RJ 2013 | Aux Out | VHDCI / In | START | SELECT | D-PAD | Teensy 3.0 | STRUM | POW | GREEN | RED | YELLOW | BLUE | ORANGE | WMY | TLT